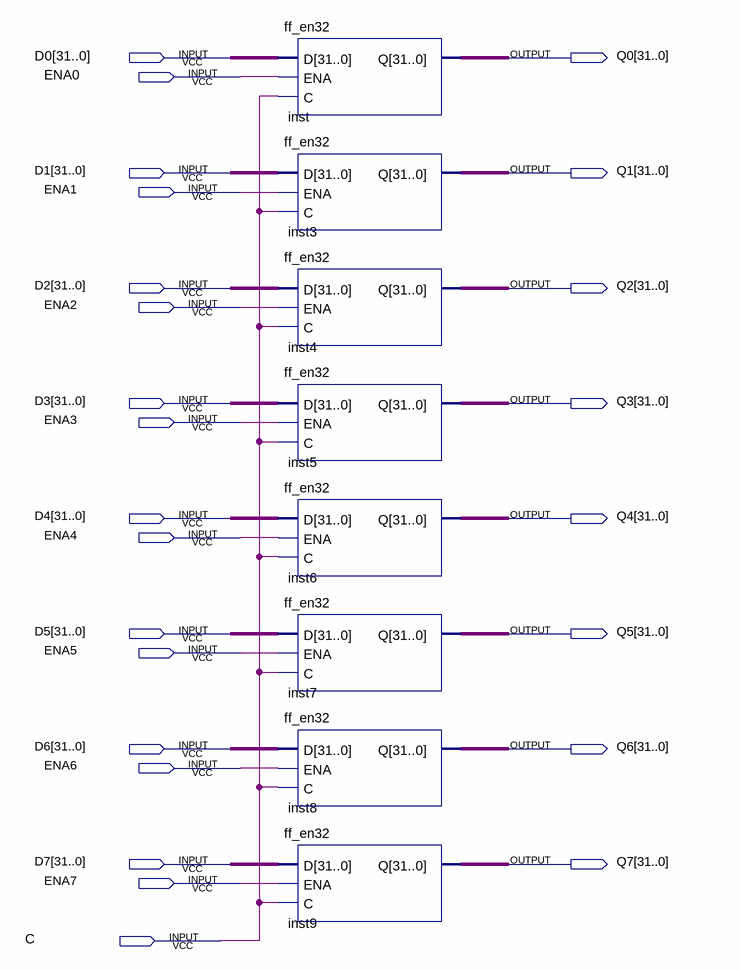
[diagram p0: schematic sheet]
// Quartus schematic ff8_en32.bdf as structural Verilog: 8 symbols, 25 pins
module ff8_en32 (
  input  [31:0] D0,
  input  ENA0,
  input  [31:0] D1,
  input  ENA1,
  input  [31:0] D2,
  input  ENA2,
  input  [31:0] D3,
  input  ENA3,
  input  [31:0] D4,
  input  ENA4,
  input  [31:0] D5,
  input  ENA5,
  input  [31:0] D6,
  input  ENA6,
  input  [31:0] D7,
  input  ENA7,
  input  C,
  output [31:0] Q0,
  output [31:0] Q1,
  output [31:0] Q2,
  output [31:0] Q3,
  output [31:0] Q4,
  output [31:0] Q5,
  output [31:0] Q6,
  output [31:0] Q7
);

  ff_en32 inst (.D(D0), .ENA(ENA0), .C(C), .Q(Q0));
  ff_en32 inst3 (.D(D1), .ENA(ENA1), .C(C), .Q(Q1));
  ff_en32 inst4 (.D(D2), .ENA(ENA2), .C(C), .Q(Q2));
  ff_en32 inst5 (.D(D3), .ENA(ENA3), .C(C), .Q(Q3));
  ff_en32 inst6 (.D(D4), .ENA(ENA4), .C(C), .Q(Q4));
  ff_en32 inst7 (.D(D5), .ENA(ENA5), .C(C), .Q(Q5));
  ff_en32 inst8 (.D(D6), .ENA(ENA6), .C(C), .Q(Q6));
  ff_en32 inst9 (.D(D7), .ENA(ENA7), .C(C), .Q(Q7));
endmodule
